# EAGLE design Butia Eagle v7 (EAGLE 5.09)
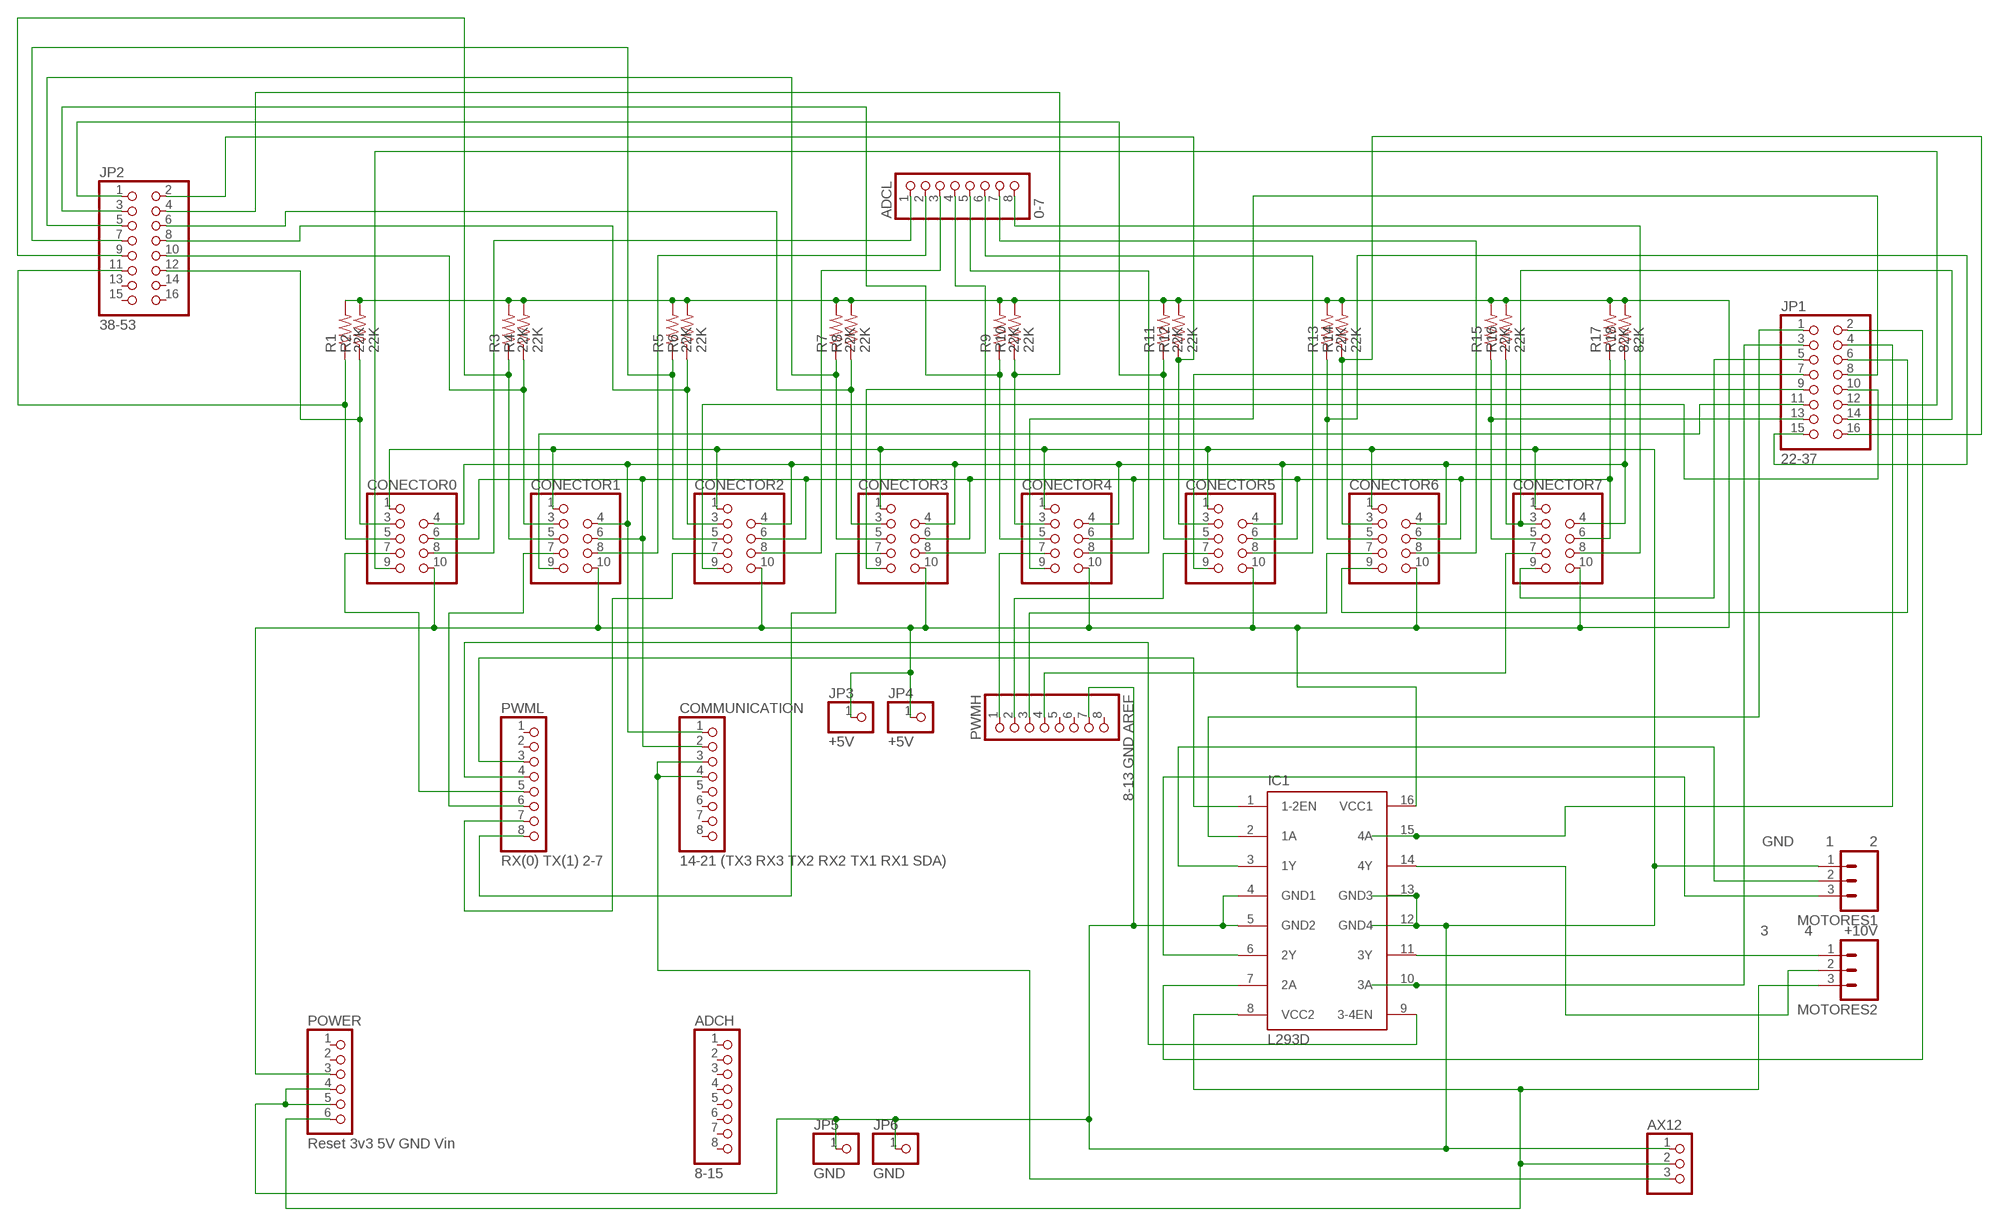
[diagram p0: schematic, sheet 1]

## Parts
ADCH  8-15  PINHD-1X8  [1X08]
ADCL  0-7  PINHD-1X8  [1X08]
AX12  AX12  [AX12]
COMMUNICATION  14-21 (TX3 RX3 TX2 RX2 TX1 RX1 SDA)  PINHD-1X8  [1X08]
CONECTOR0  9PIN  [9PIN]
CONECTOR1  9PIN  [9PIN]
CONECTOR2  9PIN  [9PIN]
CONECTOR3  9PIN  [9PIN]
CONECTOR4  9PIN  [9PIN]
CONECTOR5  9PIN  [9PIN]
CONECTOR6  9PIN  [9PIN]
CONECTOR7  9PIN  [9PIN]
IC1  L293D  [DIL16]
JP1  22-37  PINHD-2X8  [2X08]
JP2  38-53  PINHD-2X8  [2X08]
JP3  +5V  PINHD-1X1  [1X01]
JP4  +5V  PINHD-1X1  [1X01]
JP5  GND  PINHD-1X1  [1X01]
JP6  GND  PINHD-1X1  [1X01]
MOTORES1  GND 1 2  M03SCREW_LOCK  [SCREWTERMINAL-3.5MM-3_LOCK.007S]
MOTORES2  3 4 +10V  M03SCREW_LOCK  [SCREWTERMINAL-3.5MM-3_LOCK.007S]
POWER  Reset 3v3 5V GND Vin  PINHD-1X6  [1X06]
PWMH  8-13 GND AREF  PINHD-1X8  [1X08]
PWML  RX(0) TX(1) 2-7  PINHD-1X8  [1X08]
R1  22K  R-US_0207/7  [0207/7]
R2  22K  R-US_0207/7  [0207/7]
R3  22K  R-US_0207/7  [0207/7]
R4  22K  R-US_0207/7  [0207/7]
R5  22K  R-US_0207/7  [0207/7]
R6  22K  R-US_0207/7  [0207/7]
R7  22K  R-US_0207/7  [0207/7]
R8  22K  R-US_0207/7  [0207/7]
R9  22K  R-US_0207/7  [0207/7]
R10  22K  R-US_0207/7  [0207/7]
R11  22K  R-US_0207/7  [0207/7]
R12  22K  R-US_0207/7  [0207/7]
R13  22K  R-US_0207/7  [0207/7]
R14  22K  R-US_0207/7  [0207/7]
R15  22K  R-US_0207/7  [0207/7]
R16  22K  R-US_0207/7  [0207/7]
R17  82K  R-US_0207/7  [0207/7]
R18  82K  R-US_0207/7  [0207/7]

## Nets
+10V [power]: AX12.2 IC1.8(VCC2) MOTORES2.3 POWER.6
MASA [gnd]: AX12.1 CONECTOR0.1 CONECTOR1.1 CONECTOR2.1 CONECTOR3.1 CONECTOR4.1 CONECTOR5.1 CONECTOR6.1 CONECTOR7.1 IC1.4(GND1) IC1.5(GND2) IC1.12(GND4) IC1.13(GND3) JP5.1 JP6.1 MOTORES1.1 POWER.4 POWER.5 PWMH.7
N$1: CONECTOR0.5 JP2.11 R1.1
N$2: CONECTOR0.3 JP2.12 R2.1
N$3: CONECTOR1.5 JP2.9 R3.1
N$4: CONECTOR1.3 JP2.10 R4.1
N$5: CONECTOR2.5 JP2.7 R5.1
N$6: CONECTOR2.3 JP2.8 R6.1
N$8: CONECTOR3.5 JP2.5 R7.1
N$9: CONECTOR3.3 JP2.6 R8.1
N$10: CONECTOR4.3 JP2.4 R10.1
N$11: CONECTOR4.5 JP2.3 R9.1
N$13: CONECTOR5.3 JP2.2 R12.1
N$15: CONECTOR6.3 JP1.16 R14.1
N$16: CONECTOR7.5 JP1.13 R15.1
N$17: CONECTOR7.3 JP1.14 R16.1
N$18: ADCL.1 CONECTOR0.8
N$19 [polenta]: IC1.14(4Y) MOTORES2.2
N$20 [polenta]: IC1.11(3Y) MOTORES2.1
N$21 [polenta]: IC1.6(2Y) MOTORES1.3
N$22 [polenta]: IC1.3(1Y) MOTORES1.2
N$23: ADCL.2 CONECTOR1.8
N$24: ADCL.3 CONECTOR2.8
N$25: ADCL.4 CONECTOR3.8
N$26: ADCL.5 CONECTOR4.8
N$27: ADCL.6 CONECTOR5.8
N$28: ADCL.7 CONECTOR6.8
N$29: ADCL.8 CONECTOR7.8
N$30: AX12.3 COMMUNICATION.3 COMMUNICATION.4
N$31: IC1.1(1-2EN) PWML.3
N$32: IC1.9(3-4EN) PWML.4
N$33: CONECTOR0.7 PWML.5
N$34: CONECTOR1.7 PWML.6
N$35: CONECTOR2.7 PWML.7
N$36: CONECTOR3.7 PWML.8
N$37: CONECTOR4.7 PWMH.1
N$38: CONECTOR5.7 PWMH.2
N$39: CONECTOR6.7 PWMH.3
N$40: CONECTOR7.7 PWMH.4
N$41: IC1.2(1A) JP1.1
N$42: IC1.7(2A) JP1.2
N$43: IC1.10(3A) JP1.3
N$44: IC1.15(4A) JP1.4
N$45: CONECTOR7.9 JP1.5
N$46: CONECTOR6.9 JP1.6
N$47: CONECTOR5.9 JP1.7
N$48: CONECTOR4.9 JP1.8
N$49: CONECTOR3.9 JP1.9
N$50: CONECTOR2.9 JP1.10
N$51: CONECTOR1.9 JP1.11
N$52: CONECTOR0.9 JP1.12
N$53: CONECTOR5.5 JP2.1 R11.1
N$54: CONECTOR6.5 JP1.15 R13.1
POSITIVO [power]: CONECTOR0.10 CONECTOR1.10 CONECTOR2.10 CONECTOR3.10 CONECTOR4.10 CONECTOR5.10 CONECTOR6.10 CONECTOR7.10 IC1.16(VCC1) JP3.1 JP4.1 POWER.3 R1.2 R2.2 R3.2 R4.2 R5.2 R6.2 R7.2 R8.2 R9.2 R10.2 R11.2 R12.2 R13.2 R14.2 R15.2 R16.2 R17.2 R18.2
SCL: COMMUNICATION.1 CONECTOR0.4 CONECTOR1.4 CONECTOR2.4 CONECTOR3.4 CONECTOR4.4 CONECTOR5.4 CONECTOR6.4 CONECTOR7.4 R18.1
SDA: COMMUNICATION.2 CONECTOR0.6 CONECTOR1.6 CONECTOR2.6 CONECTOR3.6 CONECTOR4.6 CONECTOR5.6 CONECTOR6.6 CONECTOR7.6 R17.1
Unconnected: ADCH.1 ADCH.2 ADCH.3 ADCH.4 ADCH.5 ADCH.6 ADCH.7 ADCH.8 COMMUNICATION.5 COMMUNICATION.6 COMMUNICATION.7 COMMUNICATION.8 JP2.13 JP2.14 JP2.15 JP2.16 POWER.1 POWER.2 PWMH.5 PWMH.6 PWMH.8 PWML.1 PWML.2

## Library data of the parts
ADCH ADCL COMMUNICATION PWMH PWML = pinhead:PINHD-1X8: PIN HEADER
AX12 = butia:AX12
CONECTOR0 CONECTOR1-CONECTOR7 = butia:9PIN
IC1 = st-microelectronics:L293D: PUSH-PULL 4 CHANNEL DRIVER
JP1 JP2 = pinhead:PINHD-2X8: PIN HEADER
JP3-JP6 = pinhead:PINHD-1X1: PIN HEADER
MOTORES1 MOTORES2 = SparkFun:M03: Header 3 Standard 3-pin 0.1" header. Use with straight break away headers (SKU : PRT-00116), right angle break away headers (PRT-00553), swiss pins (PRT-00743), machine pins (PRT-00117), and female headers (PRT-00115). Molex polarized connector foot print use with SKU : PRT-08232 with associated crimp pins and housings.
POWER = pinhead:PINHD-1X6: PIN HEADER
R1-R18 = resistor:R-US_: RESISTOR, American symbol

## Net classes
0 default: width 0.229 mm, drill 0.406 mm, clearance 0.203 mm
1 power: width 0.508 mm, drill 0.711 mm, clearance 0.203 mm
2 gnd: width 0.406 mm, drill 0.61 mm, clearance 0.203 mm
3 polenta: width 0.356 mm, drill 0.508 mm, clearance 0.203 mm

## Board
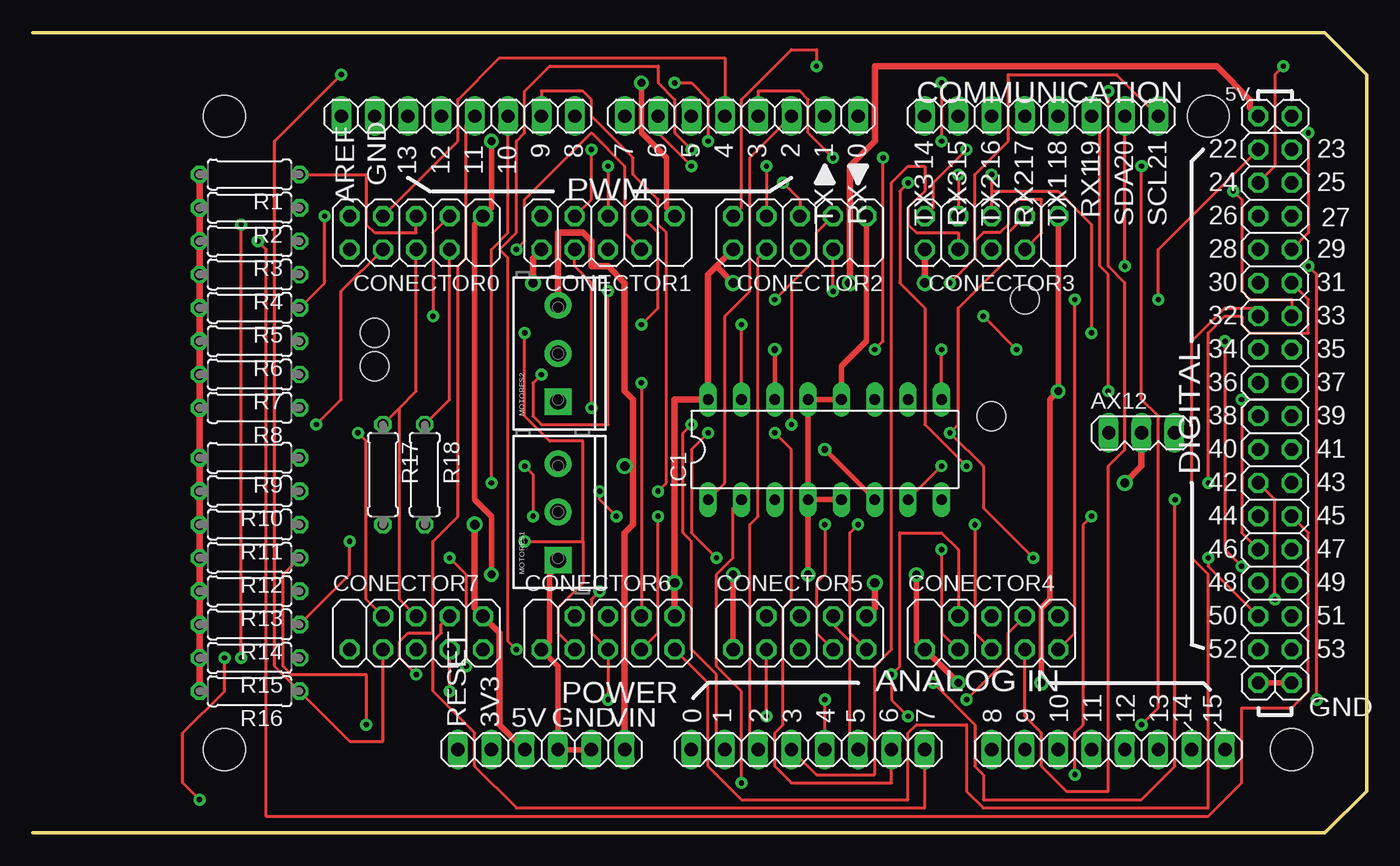
[diagram p1: board, top side]
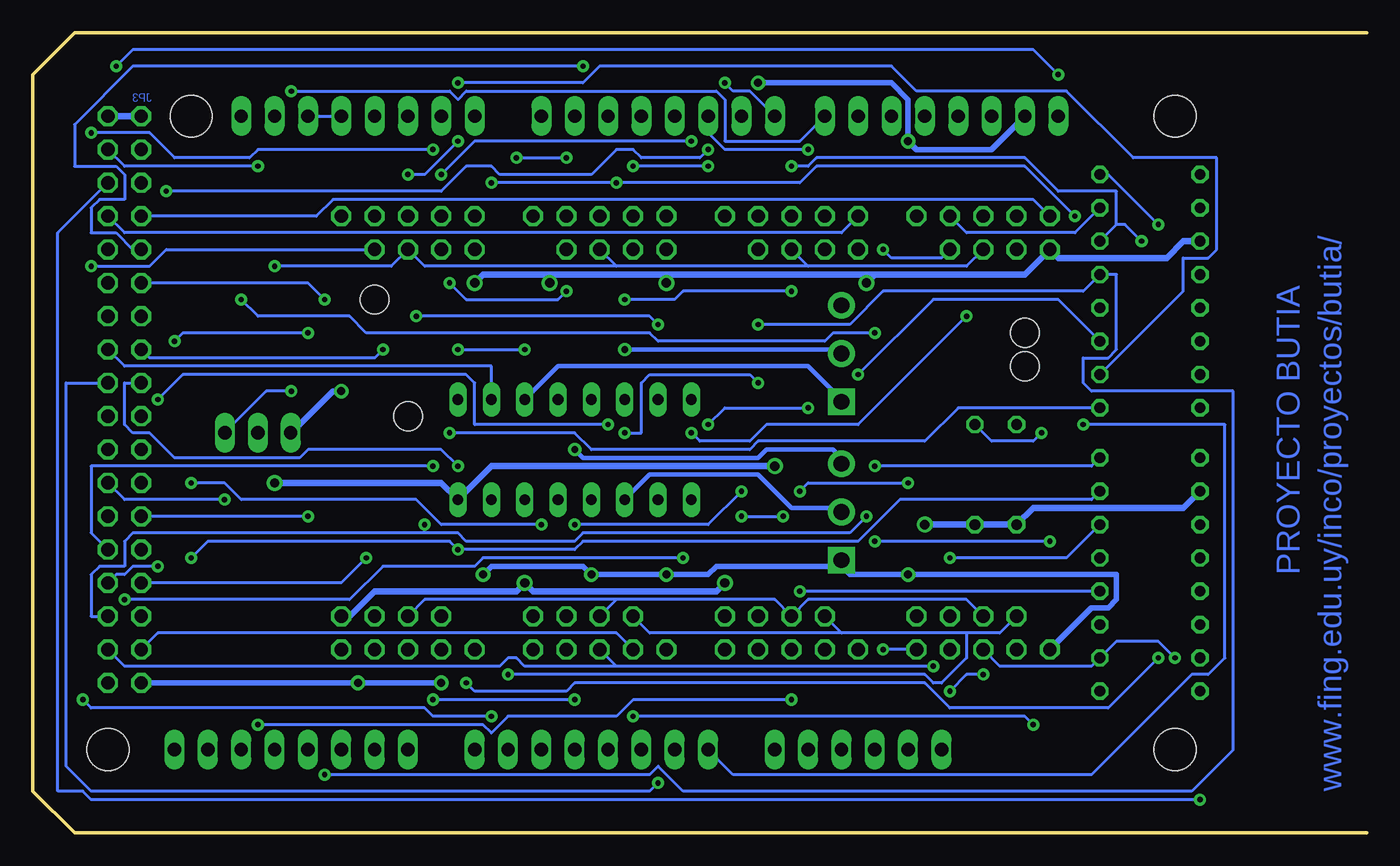
[diagram p2: board, bottom side, seen from below]

Size 101.6 x 60.96 mm. Coordinates in mm from the lower left corner, seen from the top.
Outline: 0,60.96 98.42,60.96 101.6,57.79 101.6,3.17 98.42,0 0,0
Copper layers (1*16): Top 0.035mm / dielectric 1.5mm / Bottom 0.035mm
Design rules "default *": minimum track width 8mil, minimum drill 16mil, track to track 8mil, track to pad 8mil, pad to pad 8mil, via to via 10mil, smd to smd 8mil, copper to edge 40mil, drill to drill 12mil, minimum pad ring 10mil, minimum via ring 10mil, stop-mask expansion 4mil, vias tented up to drill 0mil, thermal gap 10mil
Holes 3.2 mm at 95.88,6.35 14.61,54.61 89.53,54.61 14.61,6.35
Holes 2.2 mm at 75.56,40.64 26.04,38.1 26.04,35.56 73.02,31.75

### Footprints (pad centres in the part's own frame; a part is rotated, then mirrored left to right if it is on the bottom)
1X08 = drill 1.016 long: 1 -8.89,0; 2 -6.35,0; 3 -3.81,0; 4 -1.27,0; 5 1.27,0; 6 3.81,0; 7 6.35,0; 8 8.89,0
AX12 = drill 1.016 long: 1 -2.498,0; 2 0,0; 3 2.507,0.005
9PIN = drill 1.016 octagon: 1 -5.08,-1.27; 3 -2.54,-1.27; 4 -2.54,1.27; 5 0,-1.27; 6 0,1.27; 7 2.54,-1.27; 8 2.54,1.27; 9 5.08,-1.27; 10 5.08,1.27
DIL16 = drill 0.813 long: 1 -8.89,-3.81; 2 -6.35,-3.81; 3 -3.81,-3.81; 4 -1.27,-3.81; 5 1.27,-3.81; 6 3.81,-3.81; 7 6.35,-3.81; 8 8.89,-3.81; 9 8.89,3.81; 10 6.35,3.81; 11 3.81,3.81; 12 1.27,3.81; 13 -1.27,3.81; 14 -3.81,3.81; 15 -6.35,3.81; 16 -8.89,3.81
2X08 = drill 1.016 octagon: 1 -8.89,-1.27; 2 -8.89,1.27; 3 -6.35,-1.27; 4 -6.35,1.27; 5 -3.81,-1.27; 6 -3.81,1.27; 7 -1.27,-1.27; 8 -1.27,1.27; 9 1.27,-1.27; 10 1.27,1.27; 11 3.81,-1.27; 12 3.81,1.27; 13 6.35,-1.27; 14 6.35,1.27; 15 8.89,-1.27; 16 8.89,1.27
1X01 = drill 1.016 octagon: 1 0,0
SCREWTERMINAL-3.5MM-3_LOCK.007S = drill 1.2 pad 2.032 square: 1 -0.178,0 | drill 1.2 pad 2.032 round: 2 3.5,0; 3 7.178,0
1X06 = drill 1.016 long: 1 -6.35,0; 2 -3.81,0; 3 -1.27,0; 4 1.27,0; 5 3.81,0; 6 6.35,0
0207/7 = drill 0.813 octagon: 1 -3.81,0; 2 3.81,0

### Placement (x,y rotation side)
ADCH  81.91,6.35 0 top
ADCL  59.05,6.35 0 top
AX12  84.45,30.48 0 top
COMMUNICATION  76.83,54.61 180 top
CONECTOR0  29.21,45.72 180 top
CONECTOR1  43.82,45.72 180 top
CONECTOR2  58.42,45.72 180 top
CONECTOR3  73.02,45.72 180 top
CONECTOR4  73.02,15.24 0 top
CONECTOR5  58.42,15.24 0 top
CONECTOR6  43.82,15.24 0 top
CONECTOR7  29.21,15.24 0 top
IC1  60.33,29.21 0 top
JP1  94.61,43.18 90 top
JP2  94.61,22.86 90 top
JP3  93.34,54.61 0 top
JP4  95.88,54.61 0 top
JP5  93.34,11.43 0 top
JP6  95.88,11.43 0 top
MOTORES1  40.01,20.95 90 top
MOTORES2  40.01,33.02 90 top
POWER  38.73,6.35 0 top
PWMH  32.39,54.61 180 top
PWML  53.98,54.61 180 top
R1  16.51,50.16 180 top
R2  16.51,47.62 180 top
R3  16.51,45.09 180 top
R4  16.51,42.55 180 top
R5  16.51,40.01 180 top
R6  16.51,37.47 180 top
R7  16.51,34.92 180 top
R8  16.51,32.38 180 top
R9  16.51,28.57 180 top
R10  16.51,26.04 180 top
R11  16.51,23.49 180 top
R12  16.51,20.95 180 top
R13  16.51,18.41 180 top
R14  16.51,15.88 180 top
R15  16.51,13.34 180 top
R16  16.51,10.79 180 top
R17  26.67,27.3 270 top
R18  29.84,27.3 270 top

### Tracks (layer width: path | path; a pad name or v marks a point on that pad's centre or on a via)
+10V  (via drill 0.71)
  Top 0.508: v83.18,26.67 84.45,27.94 AX12.2 | POWER.6 45.09,22.86 45.72,23.49 45.72,27.94 | 45.72,27.94 45.72,33.02 45.09,33.66 45.09,41.91 43.82,43.18 42.55,43.18 42.55,45.09 41.91,45.72 40.01,45.72 MOTORES2.3 | 45.72,27.94 v45.09,27.94
  Bottom 0.508: v83.18,26.67 70.48,26.67 IC1.8 66.67,27.94 v45.09,27.94
MASA  (via drill 0.61)
  Top 0.406: CONECTOR3.1 v78.1,33.66 77.47,33.02 77.47,17.78 76.83,17.14 v76.83,11.43 | v70.48,11.43 CONECTOR4.1 67.31,14.61 v67.31,19.68 | JP5.1 JP6.1 | v34.93,52.71 34.93,47.62 CONECTOR0.1 33.66,46.36 33.66,25.4 34.93,24.13 v34.93,19.68 | CONECTOR1.1 48.26,47.62 48.26,51.44 46.36,53.34 v46.36,57.15 | IC1.4 IC1.5 | CONECTOR2.1 63.5,37.47 61.59,35.56 IC1.12 IC1.13 IC1.4 | POWER.5 POWER.4 40.01,12.7 CONECTOR6.1 39.37,14.61 39.37,19.68 40.01,20.32 MOTORES1.1 | v53.34,19.68 CONECTOR5.1 | v59.05,19.68 IC1.4
  Bottom 0.406: v78.1,33.66 78.74,33.66 81.91,30.48 AX12.1 | JP5.1 v76.83,11.43 v70.48,11.43 | PWMH.7 28.57,52.07 34.29,52.07 v34.93,52.71 34.93,55.88 36.2,57.15 v46.36,57.15 | CONECTOR7.1 20.95,17.14 19.68,17.14 19.05,17.78 19.05,19.68 v34.93,19.68 39.37,19.68 40.01,20.32 | 40.01,20.32 49.53,20.32 50.16,19.68 v53.34,19.68 v59.05,19.68 59.69,20.32 66.67,20.32 v67.31,19.68 | 40.01,20.32 MOTORES1.1
N$1  (via drill 0.41)
  Top 0.229: R1.1 25.4,50.16 25.4,46.36 26.04,45.72 29.21,45.72 CONECTOR0.5 | v86.99,25.4 86.99,5.08 84.45,2.54 72.39,2.54 72.39,4.45 71.75,5.08 71.75,8.26 v68.58,11.43 | v15.88,13.34 v15.88,46.36
  Bottom 0.229: JP2.11 94.61,25.4 v86.99,25.4 | v68.58,11.43 67.94,10.79 60.96,10.79 60.33,11.43 33.66,11.43 31.75,9.53 19.68,9.53 v15.88,13.34 | v15.88,46.36 19.68,50.16 R1.1
N$2  (via drill 0.41)
  Top 0.229: JP2.12 94.61,25.4 v94.61,17.78 | v52.07,20.95 50.16,22.86 50.16,29.21 v51.44,30.48 | v30.48,39.37 30.48,45.72 CONECTOR0.3
  Bottom 0.229: R2.1 22.22,45.72 30.48,45.72 CONECTOR0.3 | v94.61,17.78 77.47,17.78 74.93,20.32 67.94,20.32 67.31,20.95 v52.07,20.95 | v51.44,30.48 50.8,29.84 46.99,29.84 45.72,31.11 38.73,31.11 v30.48,39.37
N$3  (via drill 0.41)
  Top 0.229: v43.82,50.8 CONECTOR1.5 | JP2.9 97.16,22.86 97.16,10.79 95.88,9.53 92.07,9.53 92.07,3.81 89.53,1.27 17.78,1.27 17.78,44.45 v17.14,45.09
  Bottom 0.229: 19.05,46.36 R3.1 | 19.05,46.36 19.05,48.9 23.49,48.9 26.04,51.44 41.91,51.44 42.55,50.8 v43.82,50.8 | v17.14,45.09 18.41,46.36 19.05,46.36
N$4  (via drill 0.41)
  Top 0.229: v46.36,38.73 47.62,40.01 47.62,45.72 CONECTOR1.3 | v80.64,24.13 80.01,23.49 80.01,8.26 79.38,7.62 v79.38,4.45
  Bottom 0.229: v46.36,38.73 39.37,38.73 36.83,41.28 21.59,41.28 R4.1 19.05,42.55 19.05,36.83 19.68,36.2 21.59,36.2 21.59,34.29 20.95,33.66 10.16,33.66 10.16,6.35 13.34,3.17 52.07,3.17 53.98,5.08 54.61,4.45 v79.38,4.45 | v80.64,24.13 JP2.10
N$5  (via drill 0.41)
  Top 0.229: R5.1 22.22,41.91 v22.22,46.99 | v57.15,49.53 58.42,48.26 CONECTOR2.5 | v71.12,27.94 67.94,31.11 67.94,40.01 66.04,41.91 66.04,48.9 v66.67,49.53
  Bottom 0.229: v22.22,46.99 26.04,50.8 41.91,50.8 43.18,49.53 v57.15,49.53 v66.67,49.53 | JP2.7 97.16,22.86 97.16,27.94 v71.12,27.94
N$6  (via drill 0.41)
  Top 0.229: v38.73,34.92 38.1,34.29 38.1,31.75 38.73,31.11 43.82,31.11 v43.82,41.28 | 57.79,41.91 59.69,43.82 59.69,45.72 CONECTOR2.3 | v56.52,40.64 57.79,41.91 | JP2.8 92.07,22.86 v92.07,33.02 | 57.79,41.91 v57.79,31.11
  Bottom 0.229: R6.1 23.49,40.64 33.02,40.64 v38.73,34.92 | v43.82,41.28 52.07,41.28 52.71,40.64 v56.52,40.64 | v92.07,33.02 90.17,34.92 68.58,34.92 67.94,34.29 67.94,31.11 v57.79,31.11
N$8  (via drill 0.41)
  Top 0.229: v69.21,57.15 v69.21,52.71 | 73.02,48.9 CONECTOR3.5 | v73.02,50.16 73.02,48.9 | v92.07,20.32 90.8,21.59 v90.8,37.47 | v80.64,38.1 80.64,46.36 78.1,48.9 73.02,48.9
  Bottom 0.229: R7.1 13.97,41.28 13.97,43.82 12.06,43.82 11.43,44.45 11.43,51.44 17.78,51.44 22.86,56.52 34.29,56.52 36.2,58.42 58.42,58.42 59.69,57.15 v69.21,57.15 | v69.21,52.71 71.75,50.16 v73.02,50.16 | JP2.5 95.25,19.68 94.61,19.68 93.98,20.32 v92.07,20.32 | v90.8,37.47 90.17,38.1 v80.64,38.1
N$9  (via drill 0.41)
  Top 0.229: CONECTOR3.3 74.3,45.72 74.3,43.82 70.48,40.01 70.48,31.11 v69.85,30.48 72.39,27.94 72.39,24.76 v76.2,20.95
  Bottom 0.229: R8.1 31.11,32.38 33.66,29.84 46.36,29.84 46.99,29.21 59.05,29.21 60.33,30.48 v69.85,30.48 | JP2.6 78.1,19.05 v76.2,20.95
N$10  (via drill 0.41)
  Top 0.229: v69.21,21.59 69.21,15.24 CONECTOR4.3 | JP2.4 89.53,20.32 v89.53,20.95
  Bottom 0.229: R10.1 20.95,25.4 35.56,25.4 38.73,22.22 59.69,22.22 60.33,21.59 v69.21,21.59 69.85,22.22 88.27,22.22 v89.53,20.95
N$11  (via drill 0.41)
  Top 0.229: v37.47,27.94 38.1,27.3 v38.1,24.13 | CONECTOR4.5 71.75,15.24 v71.75,23.49
  Bottom 0.229: R9.1 20.95,27.94 v37.47,27.94 | v38.1,24.13 39.37,22.86 59.69,22.86 60.33,22.22 68.58,22.22 69.21,22.86 71.75,22.86 | 71.75,22.86 93.98,22.86 94.61,22.22 94.61,20.32 96.52,20.32 97.16,19.68 97.16,16.51 JP2.3 | 71.75,22.86 v71.75,23.49
N$13  (via drill 0.41)
  Top 0.229: R12.1 19.05,19.68 19.05,12.7 19.68,12.07 25.4,12.07 v25.4,8.26 | v55.88,8.89 CONECTOR5.3
  Bottom 0.229: v25.4,8.26 26.04,8.89 v55.88,8.89 | JP2.2 92.07,15.24 57.15,15.24 CONECTOR5.3
N$15  (via drill 0.41)
  Top 0.229: R14.1 24.13,19.68 v24.13,22.22 | v37.47,22.22 41.91,22.22 | 41.91,22.22 41.91,19.05 40.01,17.14 40.01,15.24 CONECTOR6.3 | JP1.16 85.72,44.45 v85.72,40.64 | v37.47,38.1 37.47,31.75 39.37,29.84 41.91,29.84 41.91,22.22
  Bottom 0.229: v24.13,22.22 v37.47,22.22 | v85.72,40.64 84.45,39.37 77.47,39.37 76.2,38.1 54.61,38.1 53.98,37.47 41.27,37.47 40.64,38.1 v37.47,38.1
N$16  (via drill 0.41)
  Top 0.229: v12.7,2.54 11.43,3.81 11.43,7.62 14.61,10.79 v14.61,13.34
  Bottom 0.229: CONECTOR7.5 27.94,12.7 20.95,12.7 R15.1 19.05,14.61 15.88,14.61 v14.61,13.34 | JP1.13 99.69,45.72 99.69,3.17 97.79,3.17 97.16,2.54 v12.7,2.54
N$17  (via drill 0.41)
  Top 0.229: CONECTOR7.3 26.67,6.98 24.13,6.98 R16.1 18.41,12.7 18.41,52.71 v23.49,57.79 | JP1.14 94.61,50.8 94.61,57.79 v95.25,58.42
  Bottom 0.229: v95.25,58.42 93.98,59.69 25.4,59.69 v23.49,57.79
N$18  (via drill 0.41)
  Top 0.229: v21.59,31.11 23.49,33.02 23.49,41.28 CONECTOR0.8
  Bottom 0.229: ADCL.1 48.26,4.45 20.95,4.45 13.34,12.07 12.06,12.07 10.79,13.34 10.79,31.11 v21.59,31.11
N$19  (via drill 0.51)
  Top 0.356: v56.52,36.83 IC1.14
  Bottom 0.356: v56.52,36.83 40.01,36.83 MOTORES2.2
N$20
  Bottom 0.356: IC1.11 61.59,35.56 42.55,35.56 40.01,33.02 MOTORES2.1
N$21  (via drill 0.51)
  Top 0.356: v60.33,29.21 IC1.6
  Bottom 0.356: v60.33,29.21 59.69,28.57 46.36,28.57 45.72,29.21 40.64,29.21 40.01,28.57 MOTORES1.3
N$22
  Bottom 0.356: IC1.3 54.61,27.3 46.36,27.3 43.82,24.76 40.01,24.76 MOTORES1.2
N$23  (via drill 0.41)
  Top 0.229: ADCL.2 52.07,6.98 52.07,12.07 50.16,13.97 50.16,22.22 49.53,22.86 49.53,30.48 v50.16,31.11 | v42.55,32.38 42.55,41.91 41.27,43.18 CONECTOR1.8
  Bottom 0.229: v50.16,31.11 48.9,32.38 v42.55,32.38
N$24
  Top 0.229: ADCL.3 54.61,6.98 54.61,23.49 55.25,24.13 55.25,43.82 CONECTOR2.8
N$25
  Top 0.229: ADCL.4 59.69,4.45 64.13,4.45 64.13,12.7 65.41,13.97 65.41,49.53 66.67,50.8 67.94,50.8 67.94,48.9 66.67,47.62 66.67,46.36 67.31,45.72 70.48,45.72 CONECTOR3.8
N$26  (via drill 0.41)
  Top 0.229: ADCL.5 v60.33,10.16 | v71.12,10.16 74.3,13.34 74.3,15.24 CONECTOR4.8
  Bottom 0.229: v60.33,10.16 v71.12,10.16
N$27
  Top 0.229: ADCL.6 62.23,6.98 62.23,14.61 60.96,15.88 CONECTOR5.8
N$28  (via drill 0.41)
  Top 0.229: v46.36,34.29 CONECTOR6.8 | v56.52,30.48 57.79,29.21 57.79,17.78 57.15,17.14 57.15,8.26 56.52,7.62 56.52,5.08 57.79,3.81 65.41,3.81 ADCL.7
  Bottom 0.229: v46.36,34.29 46.99,34.92 54.61,34.92 55.25,34.29 55.25,30.48 v56.52,30.48
N$29
  Top 0.229: CONECTOR7.8 31.11,15.88 31.11,15.24 30.48,14.61 30.48,10.79 33.66,7.62 33.66,5.08 36.83,1.91 67.94,1.91 ADCL.8
N$30  (via drill 0.41)
  Top 0.229: v81.91,33.66 81.91,42.55 81.28,43.18 81.28,53.98 COMMUNICATION.3
  Bottom 0.229: COMMUNICATION.3 COMMUNICATION.4 | v81.91,33.66 83.82,33.66 86.36,31.11 AX12.3
N$31
  Top 0.229: IC1.1 52.71,26.67 52.71,39.37 54.61,41.28 54.61,51.44 PWML.3
N$32  (via drill 0.41)
  Top 0.229: IC1.9 v69.21,36.83 | v64.13,36.83 64.77,37.47 v64.77,51.44 | v60.96,51.44 59.05,53.34 59.05,55.88 58.42,56.52 55.25,56.52 PWML.4
  Bottom 0.229: v69.21,36.83 v64.13,36.83 | v64.77,51.44 v60.96,51.44
N$33
  Top 0.229: CONECTOR0.7 32.39,52.71 32.39,55.88 35.56,59.05 52.71,59.05 PWML.5
N$34  (via drill 0.41)
  Top 0.229: CONECTOR1.7 42.55,48.26 v42.55,52.07
  Bottom 0.229: v42.55,52.07 48.9,52.07 50.16,53.34 PWML.6
N$35  (via drill 0.41)
  Top 0.229: v55.88,50.8 CONECTOR2.7 | v50.16,50.8 47.62,53.34 PWML.7
  Bottom 0.229: v50.16,50.8 v55.88,50.8
N$36  (via drill 0.41)
  Top 0.229: v70.48,50.16 CONECTOR3.7 | v51.44,52.71 51.44,55.88 50.16,57.15 v48.9,57.15
  Bottom 0.229: v70.48,50.16 67.94,52.71 v51.44,52.71 | v48.9,57.15 48.26,56.52 46.99,56.52 PWML.8
N$37  (via drill 0.41)
  Top 0.229: CONECTOR4.7 75.56,8.89 76.83,7.62 76.83,5.08 78.74,3.17 81.91,3.17 81.91,27.94 83.18,29.21 83.18,41.91 81.91,43.18 v81.91,56.52
  Bottom 0.229: v81.91,56.52 69.85,56.52 69.21,55.88 68.58,56.52 49.53,56.52 48.9,55.88 48.9,52.71 43.18,52.71 PWMH.1
N$38  (via drill 0.41)
  Top 0.229: CONECTOR5.7 59.69,15.24 59.69,19.05 60.33,19.68 v60.33,23.49 | v47.62,26.04 48.26,26.67 48.26,45.72 47.62,46.36 47.62,48.26 45.72,50.16 45.72,51.44 42.55,54.61 42.55,55.88 41.91,56.52 38.73,56.52 PWMH.2
  Bottom 0.229: v60.33,23.49 50.16,23.49 v47.62,26.04
N$39  (via drill 0.41)
  Top 0.229: CONECTOR6.7 47.62,15.24 v47.62,24.13 | v44.45,24.13 43.18,25.4 v43.18,26.04 | v34.93,26.67 34.93,44.45 36.2,45.72 PWMH.3
  Bottom 0.229: v47.62,24.13 v44.45,24.13 | v43.18,26.04 42.55,26.67 v34.93,26.67
N$40  (via drill 0.41)
  Top 0.229: v31.75,10.79 CONECTOR7.7 | v29.21,12.07 27.94,13.34 27.94,14.61 28.57,15.24 30.48,15.24 30.48,22.22 32.39,24.13 32.39,43.18 33.02,43.82 33.02,53.98 PWMH.4
  Bottom 0.229: v31.75,10.79 30.48,12.07 v29.21,12.07
N$41  (via drill 0.41)
  Top 0.229: IC1.2 53.34,24.76 53.34,20.95 52.07,19.68 52.07,12.7 53.98,10.79 v53.98,3.81
  Bottom 0.229: v53.98,3.81 54.61,3.17 97.16,3.17 99.06,5.08 99.06,34.29 JP1.1
N$42  (via drill 0.41)
  Top 0.229: IC1.7 v69.21,27.94
  Bottom 0.229: v69.21,27.94 70.48,29.21 80.64,29.21 81.28,28.57 90.8,28.57 92.71,30.48 93.98,30.48 94.61,31.11 94.61,34.29 JP1.2
N$43
  Bottom 0.229: IC1.10 66.67,35.56 94.61,35.56 JP1.3
N$44  (via drill 0.41)
  Top 0.229: IC1.15 v53.98,38.73 | v72.39,39.37 v74.93,36.83
  Bottom 0.229: v53.98,38.73 54.61,39.37 v72.39,39.37 | v74.93,36.83 75.56,36.2 92.71,36.2 JP1.4
N$45  (via drill 0.41)
  Top 0.229: v36.83,13.97 36.2,14.61 36.2,43.82 35.56,44.45 36.83,45.72 36.83,52.71 37.47,53.34 37.47,56.52 39.37,58.42 47.62,58.42 47.62,57.15 48.9,55.88 48.9,53.34 v50.16,52.07 | v91.44,48.9 92.07,48.26 92.07,41.28 92.71,40.64 95.88,40.64 JP1.5
  Bottom 0.229: CONECTOR7.9 v36.83,13.97 | v50.16,52.07 50.8,51.44 55.25,51.44 55.88,52.07 57.15,52.07 59.05,50.16 66.04,50.16 66.67,50.8 68.58,50.8 70.48,48.9 v91.44,48.9
N$46
  Top 0.229: CONECTOR6.9 51.44,11.43 51.44,5.08 53.98,2.54 66.67,2.54 66.67,7.62 67.31,8.26 71.12,8.26 71.12,3.17 72.39,1.91 89.53,1.91 89.53,19.68 88.27,20.95 88.27,37.47 90.8,40.01 93.34,40.01 JP1.6
N$47  (via drill 0.41)
  Top 0.229: CONECTOR5.9 62.23,15.24 62.23,22.86 v62.87,23.49 | v89.53,26.67 89.53,38.1 90.8,39.37 92.07,39.37 92.07,38.73 92.71,38.1 97.16,38.1 97.16,40.64 JP1.7
  Bottom 0.229: v62.87,23.49 70.48,23.49 72.39,25.4 85.72,25.4 86.99,26.67 v89.53,26.67
N$48  (via drill 0.41)
  Top 0.229: CONECTOR4.9 79.38,15.24 v79.38,40.64
  Bottom 0.229: v79.38,40.64 80.64,41.91 JP1.8
N$49  (via drill 0.41)
  Top 0.229: JP1.9 97.16,45.72 v97.16,53.34 | v71.12,52.07 68.58,49.53 68.58,47.62 CONECTOR3.9
  Bottom 0.229: v97.16,53.34 92.71,53.34 90.8,51.44 85.09,51.44 84.45,52.07 v71.12,52.07
N$50  (via drill 0.41)
  Top 0.229: CONECTOR2.9 53.98,47.62 53.98,55.88 57.79,59.69 59.69,59.69 v59.69,58.42
  Bottom 0.229: v59.69,58.42 93.98,58.42 98.42,53.98 98.42,50.8 95.25,50.8 94.61,50.16 94.61,48.26 96.52,48.26 97.16,47.62 97.16,45.72 95.25,45.72 93.98,44.45 JP1.10
N$51
  Bottom 0.229: CONECTOR1.9 40.01,45.72 94.61,45.72 JP1.11
N$52
  Bottom 0.229: CONECTOR0.9 25.4,48.26 78.74,48.26 80.01,46.99 JP1.12
N$53  (via drill 0.41)
  Top 0.229: v31.75,20.95 33.02,19.68 v33.02,12.7
  Bottom 0.229: R11.1 22.86,20.95 v31.75,20.95 | v33.02,12.7 57.15,12.7 | 57.15,12.7 CONECTOR5.5 | JP2.1 94.61,12.7 66.04,12.7 65.41,13.34 64.77,13.34 64.13,12.7 57.15,12.7
N$54  (via drill 0.41)
  Top 0.229: v43.18,18.41 42.55,17.78 42.55,15.24 CONECTOR6.5 v43.82,10.16 | v84.45,50.8 84.45,33.02 85.72,31.75 85.72,9.53 v84.45,8.26
  Bottom 0.229: R13.1 v43.18,18.41 | JP1.15 94.61,50.8 v84.45,50.8 | v84.45,8.26 67.31,8.26 66.67,7.62 65.41,8.89 57.15,8.89 55.88,10.16 v43.82,10.16
POSITIVO  (via drill 0.71)
  Top 0.508: CONECTOR5.10 64.13,17.14 v64.13,19.05 | CONECTOR6.10 v48.9,19.05 48.9,33.02 IC1.16 51.44,42.55 52.07,43.18 | 52.07,43.18 CONECTOR2.10 | POWER.3 35.56,8.26 35.56,15.24 CONECTOR7.10 33.66,17.14 v33.66,23.49 | R16.2 R15.2 R14.2 R13.2 R12.2 R11.2 R10.2 R9.2 R8.2 R7.2 R6.2 R5.2 R4.2 R3.2 R2.2 R1.2 | CONECTOR1.10 38.1,43.82 v38.1,41.91 | v67.94,41.91 CONECTOR3.10 | JP3.1 92.71,55.25 92.71,55.88 90.17,58.42 64.13,58.42 64.13,52.71 62.23,50.8 v62.23,41.91 | v53.34,41.91 52.07,43.18
  Bottom 0.508: CONECTOR4.10 77.47,16.51 75.56,18.41 64.77,18.41 v64.13,19.05 63.5,18.41 49.53,18.41 v48.9,19.05 | R10.2 13.97,24.76 25.4,24.76 R17.2 R18.2 v33.66,23.49 | JP3.1 JP4.1 | R3.2 13.97,45.09 15.24,43.82 23.49,43.82 CONECTOR0.10 26.04,42.55 37.47,42.55 | 37.47,42.55 v38.1,41.91 | v67.94,41.91 67.31,42.55 62.23,42.55 | 37.47,42.55 53.34,42.55 | 53.34,42.55 62.23,42.55 | 62.23,42.55 v62.23,41.91 | 53.34,42.55 v53.34,41.91
SCL  (via drill 0.41)
  Top 0.229: v60.96,41.28 CONECTOR2.4 | v69.85,41.91 71.75,43.82 71.75,45.09 | 71.75,45.09 72.39,45.72 73.66,45.72 74.3,46.36 74.3,47.62 74.93,48.26 76.83,48.26 76.83,45.72 CONECTOR3.4 | COMMUNICATION.1 82.55,57.79 74.3,57.79 74.3,52.71 71.75,50.16 71.75,45.09 | R18.1 31.75,33.02 CONECTOR0.4 | CONECTOR1.4 45.09,45.72 45.09,50.8 42.55,53.34 37.47,48.26 37.47,45.09 v36.83,44.45 | CONECTOR4.4 70.48,21.59 69.21,22.86 66.04,22.86 66.04,12.7 v65.41,12.07 65.41,10.16 v66.67,8.89 | v24.76,30.48 25.4,29.84 25.4,17.78 CONECTOR7.4 | v97.16,43.18 97.79,42.55 v97.79,10.16
  Bottom 0.229: v60.96,41.28 61.59,40.64 68.58,40.64 v69.85,41.91 | v36.83,44.45 36.2,43.82 32.39,43.82 CONECTOR0.4 | CONECTOR7.4 27.94,15.24 30.48,15.24 | 30.48,15.24 40.01,15.24 | 40.01,15.24 CONECTOR6.4 | CONECTOR5.4 54.61,15.24 40.01,15.24 | v65.41,12.07 33.66,12.07 33.02,11.43 32.39,11.43 30.48,13.34 30.48,15.24 | R18.1 28.57,29.84 25.4,29.84 v24.76,30.48 | CONECTOR3.4 91.44,44.45 92.71,43.18 v97.16,43.18 | v97.79,10.16 97.16,9.53 71.75,9.53 71.12,8.89 v66.67,8.89
SDA  (via drill 0.41)
  Top 0.229: 27.94,32.38 29.21,33.66 CONECTOR0.6 | 27.94,32.38 R17.1 | CONECTOR7.6 27.94,17.78 27.94,32.38 | v83.18,43.18 COMMUNICATION.2
  Bottom 0.229: CONECTOR7.6 30.48,17.78 42.55,17.78 CONECTOR6.6 45.09,17.78 57.15,17.78 | 57.15,17.78 CONECTOR5.6 | CONECTOR4.6 71.75,17.78 57.15,17.78 | 42.55,43.18 CONECTOR1.6 | 42.55,43.18 30.48,43.18 CONECTOR0.6 | 57.15,43.18 CONECTOR2.6 | 42.55,43.18 57.15,43.18 | 57.15,43.18 71.75,43.18 CONECTOR3.6 74.3,43.18 v83.18,43.18

### Text on the board
Bottom: PROYECTO BUTIA | www.fing.edu.uy/inco/proyectos/butia/
tPlace: 9 | 8 | 7 | 6 | 5 | 4 | 3 | 2 | 1 | 0 | 22 | 23 | 14 | 15 | 16 | 17 | 18 | 19 | 20 | 21 | 13 | 12 | 11 | 10 | 24 | 25 | 27 | 26 | 28 | 29 | 30 | 31 | 32 | 33 | 34 | 35 | 36 | 37 | 38 | 39 | 40 | 41 | 42 | 43 | 44 | 45 | 46 | 47 | 48 | 49 | 50 | 51 | 52 | 53 | 0 | 1 | 2 | 3 | 4 | 5 | 6 | 7 | 8 | 9 | 10 | 11 | 12 | 13 | 14 | 15
tNames: 5V | GND | AREF | PWM | TX | RX | RX1 | TX3 | RX3 | TX2 | RX2 | TX1 | SDA | SCL | DIGITAL | ANALOG IN | GND | RESET | 3V3 | 5V | GND | VIN